# EasyEDA schematic SCH_Smart_Parking_IoT_2023-05-15_2.json
TITLE: Smart_Parking; REV: 1.2; Date: 2023-04-26; Sheet: 1/1; Drawn By: Nabil Bachroin; Company: NTUST
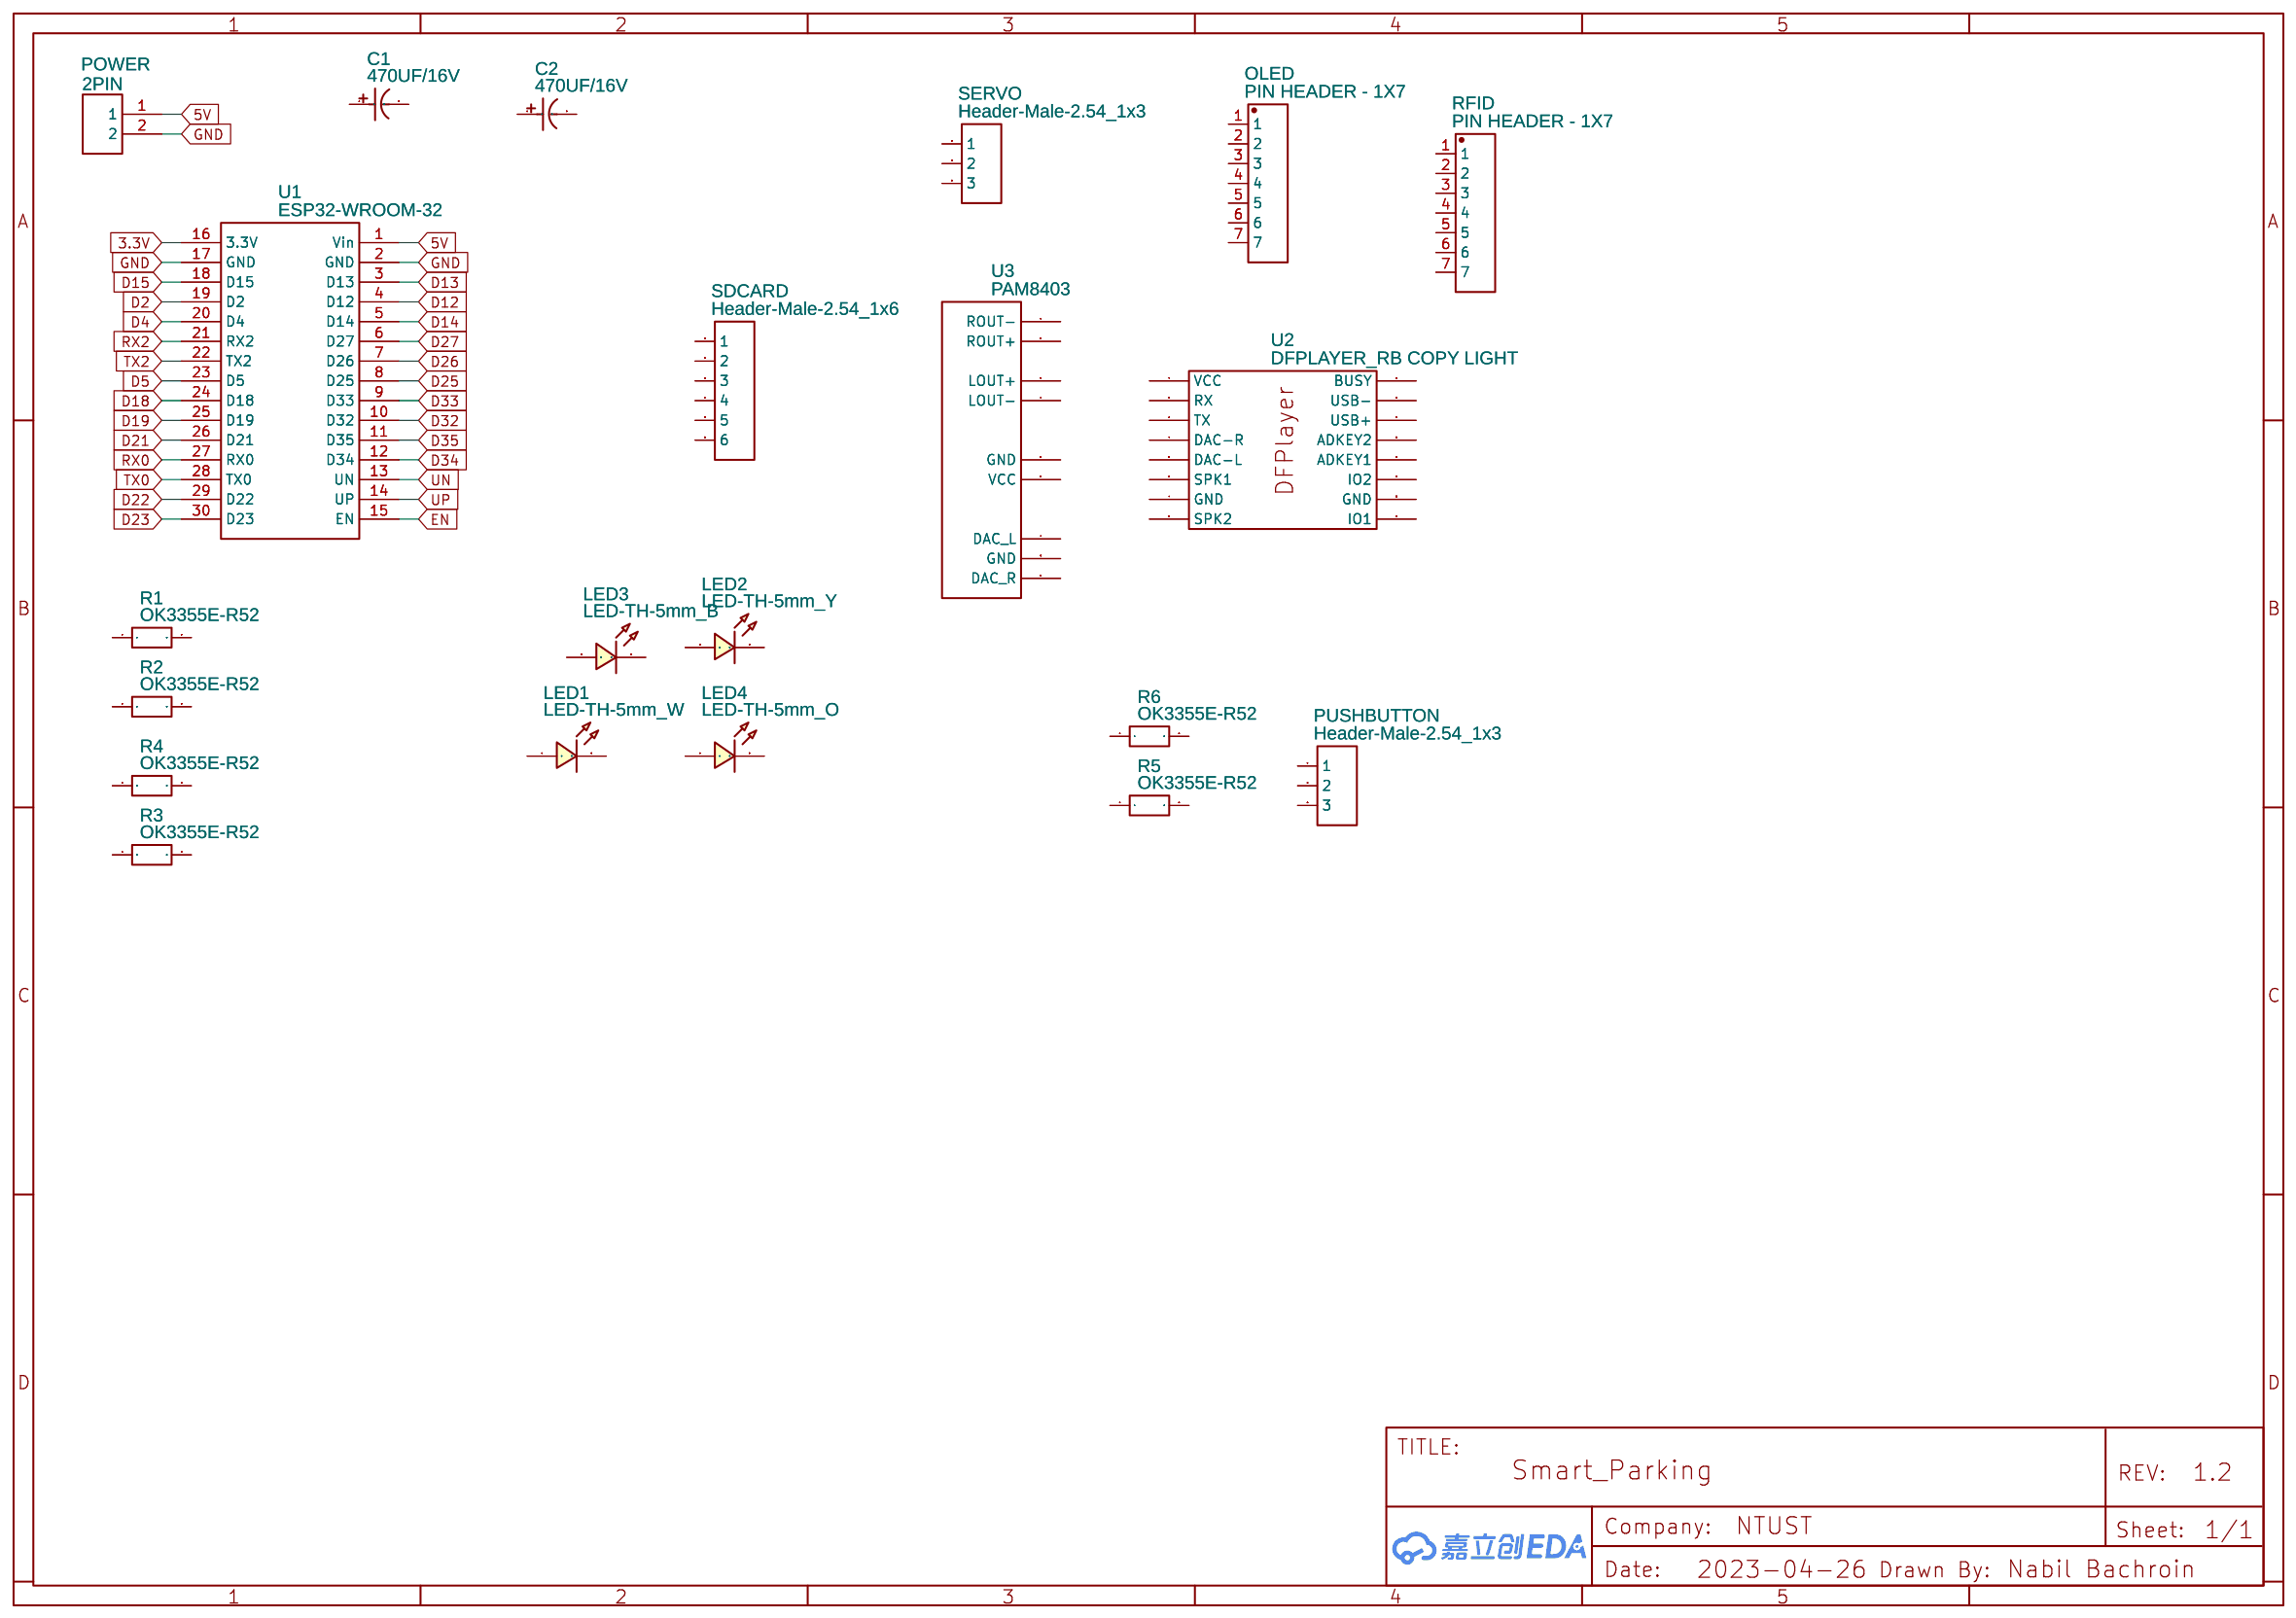
[diagram p0: schematic sheet]

## Parts
C1  470UF/16V  [CAP-TH_BD7.8-P3.25-D0.6-FD]
C2  470UF/16V  [CAP-TH_BD7.8-P3.25-D0.6-FD]
LED1  LED-TH-5mm_W  [LED-TH_BD5.0_BLUE]
LED2  LED-TH-5mm_Y  [LED-TH_BD5.0_BLUE]
LED3  LED-TH-5mm_B  [LED-TH_BD5.0_BLUE]
LED4  LED-TH-5mm_O  [LED-TH_BD5.0_BLUE]
OLED  PIN HEADER - 1X7  [HEADER - HEADER-FEMALE-2.54_1X7]
POWER  2PIN  [PINHEADER1X2]
PUSHBUTTON  Header-Male-2.54_1x3  [HDR-TH_3P-P2.54-V-M-1]
R1  OK3355E-R52  [RES-TH_BD2.5-L6.8-P10.50-D0.5]
R2  OK3355E-R52  [RES-TH_BD2.5-L6.8-P10.50-D0.5]
R3  OK3355E-R52  [RES-TH_BD2.5-L6.8-P10.50-D0.5]
R4  OK3355E-R52  [RES-TH_BD2.5-L6.8-P10.50-D0.5]
R5  OK3355E-R52  [RES-TH_BD2.5-L6.8-P10.50-D0.5]
R6  OK3355E-R52  [RES-TH_BD2.5-L6.8-P10.50-D0.5]
RFID  PIN HEADER - 1X7  [HEADER - HEADER-FEMALE-2.54_1X7]
SDCARD  Header-Male-2.54_1x6  [HDR-TH_6P-P2.54-V-M-1]
SERVO  Header-Male-2.54_1x3  [HDR-TH_3P-P2.54-V-M-1]
U1  ESP32-WROOM-32  [ESP32-WROOM-32]
U2  DFPLAYER_RB COPY LIGHT  [DFPLAYER RB]
U3  PAM8403  [PAM8403]

## Library data of the parts
C1 C2 = 470UF/16V: Supplier: LCSC; Supplier Part: C9900008131; Manufacturer Part: 470uF/16V; Contributor: LCSC; JLCPCB Part Class: Extended Part; Manufacturer: null
LED1 = LED-TH-5mm_W: Supplier: LCSC; Contributor: Danny591
LED2 = LED-TH-5mm_Y: Contributor: MariuszSzczesny
LED3 = LED-TH-5mm_B: Supplier: JDR; Contributor: wrocek_k
LED4 = LED-TH-5mm_O: Supplier: LCSC; Contributor: Рамазан Тулешкалиев
OLED RFID = PIN HEADER - 1X7: Contributor: Harald Bregu
POWER = 2PIN: Manufacturer Part: Pin_Header_2; Contributor: jesuecc83
PUSHBUTTON SERVO = Header-Male-2.54_1x3: Supplier: LCSC; Manufacturer: BOOMELE(博穆精密); Manufacturer Part: 2.54-1*3P针; Supplier Part: C49257; JLCPCB Part Class: Extended Part
R1-R6 = OK3355E-R52: Supplier: LCSC; Supplier Part: C3522642; Manufacturer: Ohmite; link: https://atta.szlcsc.comnull; Contributor: lcsc
SDCARD = Header-Male-2.54_1x6: Supplier: LCSC; Manufacturer: BOOMELE(博穆精密); Manufacturer Part: 2.54-1x6P直针; Supplier Part: C37208; JLCPCB Part Class: Extended Part
U1 = ESP32-WROOM-32: Manufacturer: Espressif; Supplier: Espressif; link: https://www.espressif.com/sites/default/files/documentation/esp32_datasheet_en.pdf; Contributor: li_necont
U2 = DFPLAYER_RB COPY LIGHT: Manufacturer Part: DFPLAYER; Contributor: rlbrinkman
U3 = PAM8403: Contributor: esalord

## Nets
3.3V: U1.16(3.3V)
5V: POWER.1 U1.1(Vin)
GND: POWER.2 U1.2(GND) U1.17(GND)
D2: U1.19(D2)
D4: U1.20(D4)
D5: U1.23(D5)
D12: U1.4(D12)
D13: U1.3(D13)
D14: U1.5(D14)
D15: U1.18(D15)
D18: U1.24(D18)
D19: U1.25(D19)
D21: U1.26(D21)
D22: U1.29(D22)
D23: U1.30(D23)
D25: U1.8(D25)
D26: U1.7(D26)
D27: U1.6(D27)
D32: U1.10(D32)
D33: U1.9(D33)
D34: U1.12(D34)
D35: U1.11(D35)
EN: U1.15(EN)
RX0: U1.27(RX0)
RX2: U1.21(RX2)
TX0: U1.28(TX0)
TX2: U1.22(TX2)
UN: U1.13(UN)
UP: U1.14(UP)

Not connected (* = marked no-connect by the designer): C1 1 2; C2 1 2; LED1 1 2; LED2 1 2; LED3 1 2; LED4 1 2; OLED 1 2 3 4 5 6 7; PUSHBUTTON 1 2 3; R1 1 2; R2 1 2; R3 1 2; R4 1 2; R5 1 2; R6 1 2; RFID 1 2 3 4 5 6 7; SDCARD 1 2 3 4 5 6; SERVO 1 2 3; U2 1(VCC) 2(RX) 3(TX) 4(DAC-R) 5(DAC-L) 6(SPK1) 7(GND) 8(SPK2) 9(IO1) 10(GND) 11(IO2) 12(ADKEY1) 13(ADKEY2) 14(USB+) 15(USB-) 16(BUSY); U3 1(ROUT-) 2(ROUT+) 3(LOUT+) 4(LOUT-) 5(GND) 6(VCC) 7(DAC_L) 8(GND) 9(DAC_R)
